# Altium schematic sheet POWER.SchDoc
size D; SheetNumber: 7; SheetTotal: 7
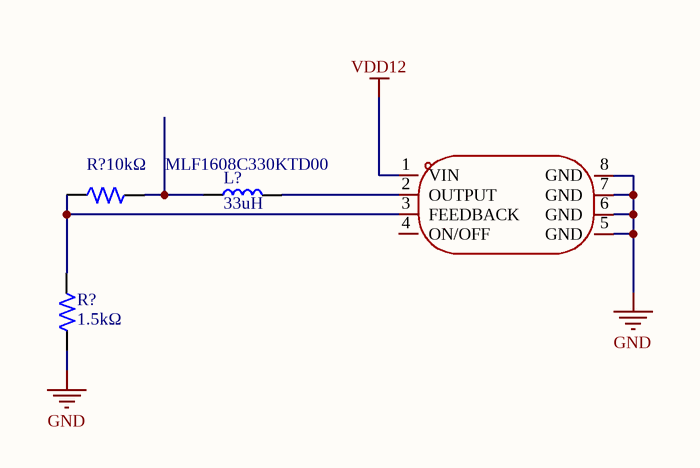
[diagram p0: POWER.SchDoc]

## Parts
(Parts that share a designator on the sheet are numbered #1, #2 ... from top to bottom, then left to right.)
L?  MLF1608C330KTD00  Inductance: 33uH  [IND-0603]
R?#1  Resistance: 10kΩ  [RES-0603]  (hidden comment: 0603WAF1002T5E)
R?#2  Resistance: 1.5kΩ  [RES-0603]  (hidden comment: 0603WAF1501T5E)
U?  XL1509-ADJ  [SOIC-8_L5.0-W4.0-P1.27-LS6.0-BL]  (value not drawn)

## Nets
GND: R?#2.1 U?.5(GND) U?.6(GND) U?.7(GND) U?.8(GND)
VDD12: U?.1(VIN)
NetL?_1: L?.1 R?#1.1
NetL?_2: L?.2 U?.2(OUTPUT)
NetR?#1_2: R?#1.2 R?#2.2 U?.3(FEEDBACK)

Not connected (* = marked no-connect by the designer): U? 4(ON/OFF)

## Library data of the parts
L? = MLF1608C330KTD00: Inductor, 33uH, ±10%, 1.4Ω, 2mA, SMD 0603; Manufacturer: TDK; Self-Resonant Frequency: 10MHz; Q Factor: 20@1MHz; Package Size: 0603; JLCPCB Basic Part: No; JLCPCB Part Number: C275351; Supplier 1: LCSC; Category: Inductors; Supplier Part Number 1: C275351; Manufacturer Part Number: MLF1608C330KTD00; Tolerance: ±10%; Rated Current: 2mA; DC Resistance: 1.4Ω; RoHS: Yes; ComponentLink1Description: Datasheet; ComponentLink1URL: https://wmsc.lcsc.com/wmsc/upload/file/pdf/v2/lcsc/2304140030_TDK-MLF1608C330KTD00_C275351.pdf; ComponentLink2Description: JLCPCB Part URL; ComponentLink2URL: https://jlcpcb.com/partdetail/C275351; ComponentLink3Description: LCSC Part URL; ComponentLink3URL: https://lcsc.com/product-detail/Inductors-SMD_TDK-TDK-MLF1608C330KTD00_C275351.html
R?#1 = 0603WAF1002T5E: Resistor, 10kΩ, ±1%, 100mW, 75V, ±100ppm/℃, -55℃~+155℃, SMD 0603; Manufacturer: Uniroyal; Supplier 1: LCSC; Manufacturer Part Number: 0603WAF1002T5E; Supplier Part Number 1: C25804; JLCPCB Part Number: C25804; Power Rating: 100mW; Category: Resistors; Package Size: 0603; JLCPCB Basic Part: Yes; Tolerance: ±1%; Voltage Rating: 75V; Temperature Coefficient: ±100ppm/℃; Temperature Rating: -55℃~+155℃; ComponentLink1Description: Datasheet; ComponentLink1URL: https://wmsc.lcsc.com/wmsc/upload/file/pdf/v2/lcsc/2206010045_UNI-ROYAL-Uniroyal-Elec-0603WAF1002T5E_C25804.pdf; ComponentLink2Description: JLCPCB Part URL; ComponentLink2URL: https://jlcpcb.com/partdetail/C25804
R?#2 = 0603WAF1501T5E: Resistor, 1.5kΩ, ±1%, 100mW, 75V, ±100ppm/℃, -55℃~+155℃, SMD 0603; Manufacturer: Uniroyal; Supplier 1: LCSC; Manufacturer Part Number: 0603WAF1501T5E; Supplier Part Number 1: C22843; JLCPCB Part Number: C22843; Power Rating: 100mW; Category: Resistors; Package Size: 0603; JLCPCB Basic Part: Yes; Tolerance: ±1%; Voltage Rating: 75V; Temperature Coefficient: ±100ppm/℃; Temperature Rating: -55℃~+155℃; ComponentLink1Description: Datasheet; ComponentLink1URL: https://wmsc.lcsc.com/wmsc/upload/file/pdf/v2/lcsc/2206010130_UNI-ROYAL-Uniroyal-Elec-0603WAF1501T5E_C22843.pdf; ComponentLink2Description: JLCPCB Part URL; ComponentLink2URL: https://jlcpcb.com/partdetail/C22843
U? = XL1509-ADJ: Manufacturer: UMW(友台半导体); Add into BOM: yes; Function: Buck; Voltage - Supply: 4.5V~40V; Output Voltage: 1.23V~37V; Output Current: 2A; Frequency - Switching: 150kHz; Synchronous Rectifier: No; Number of Outputs: 1; Quiescent Current: 2mA; Switch tube (built-in/external): Built-In; Output Type: Adjustable; Symbol: XL1509-ADJ; Device: XL1509-ADJ; LCSC Part Name: 150 KHz 固定频率 PWM 降压 DC/DC 转换器; Supplier Part: C2681227; Manufacturer Part: XL1509-ADJ; Supplier Footprint: SOIC-8; JLCPCB Part Class: Extended Part; Datasheet: https://item.szlcsc.com/datasheet/XL1509-ADJ/2773703.html; Supplier: LCSC; Convert to PCB: yes; Operating Temperature: -40℃~+125℃; Topology: Buck